# EAGLE schematic Pure Keys aec (EAGLE 8.6.0)

## Sheet 1 of 7: ATMEGA328P
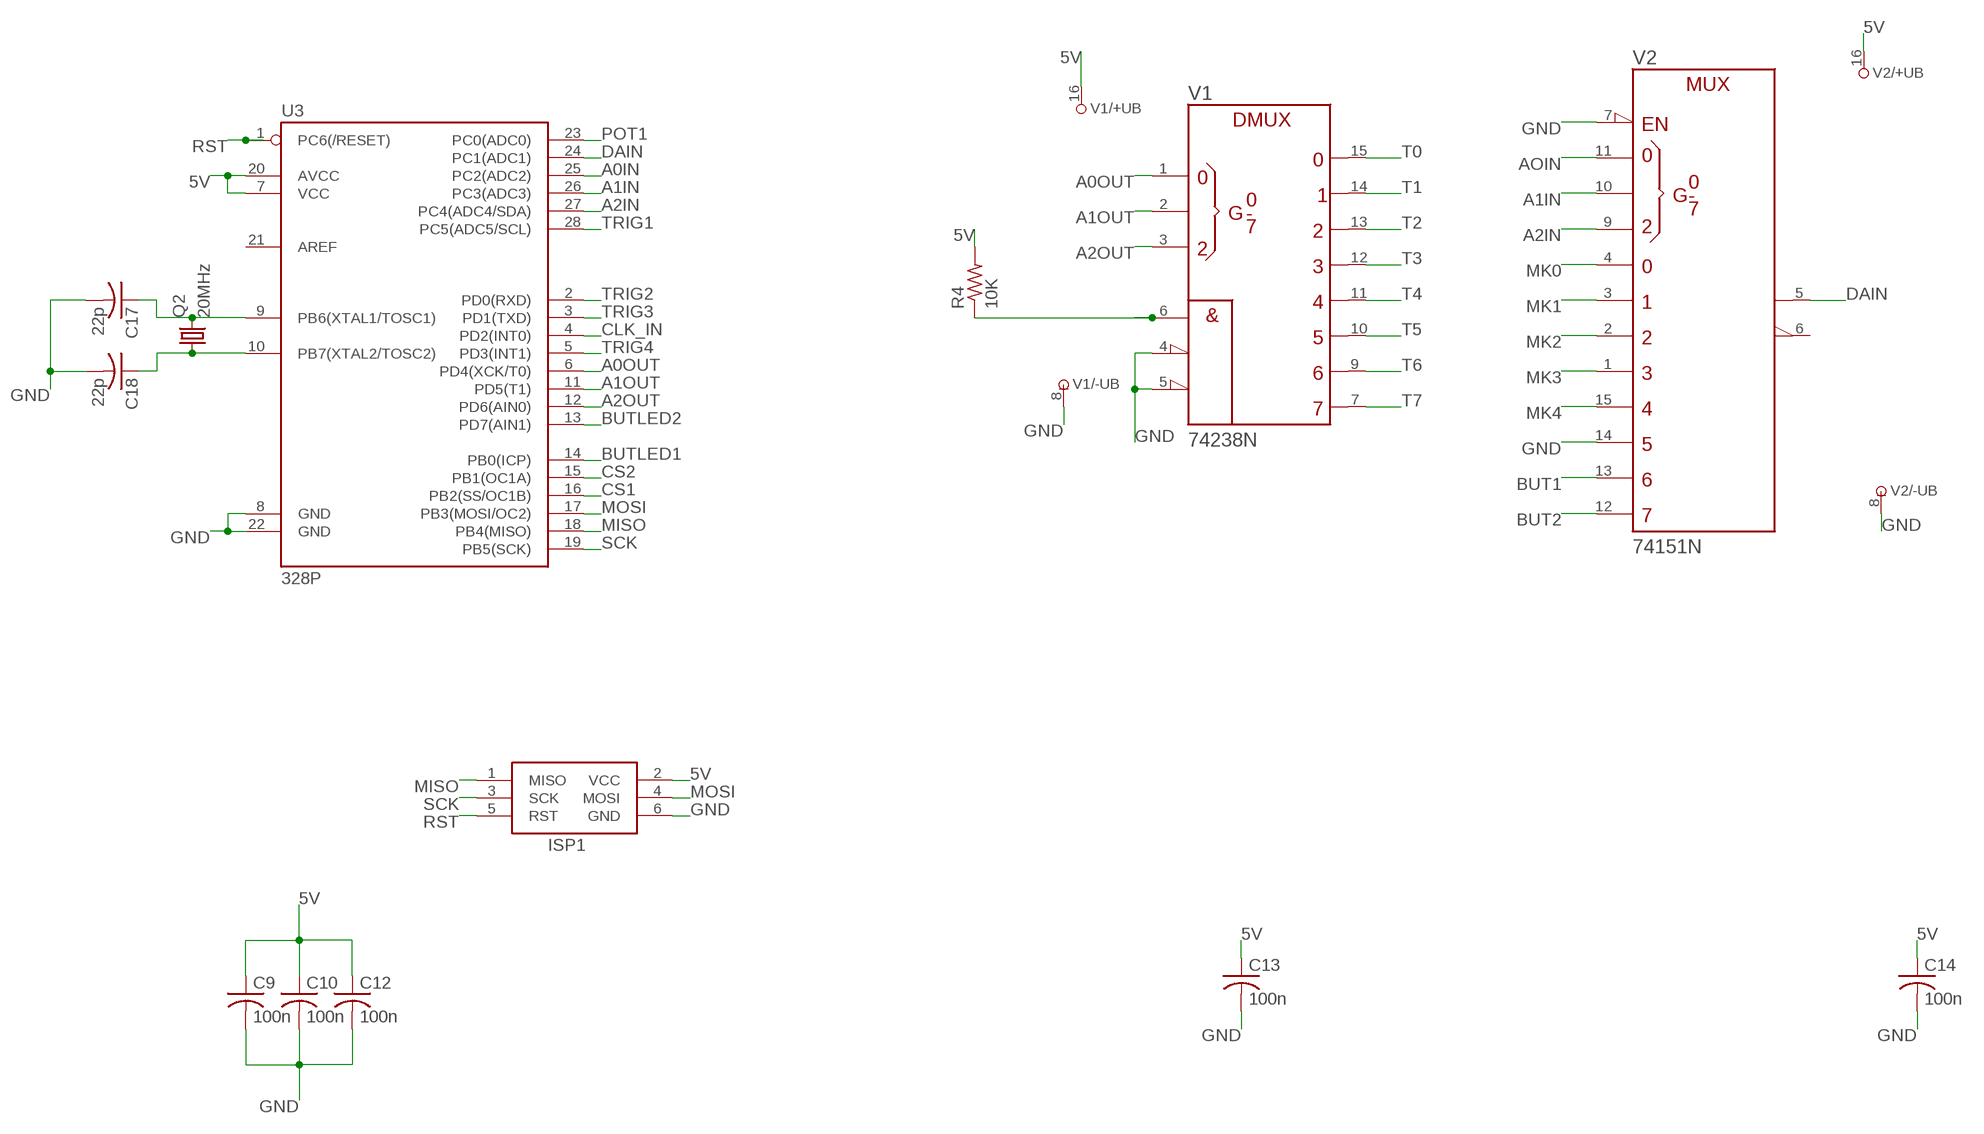
[diagram p0: schematic, sheet 1]

### Parts
C9  100n  C-USC0805K  [C0805K]
C10  100n  C-USC0805K  [C0805K]
C12  100n  C-USC0805K  [C0805K]
C13  100n  C-USC0805K  [C0805K]
C14  100n  C-USC0805K  [C0805K]
C17  22p  C-USC0805K  [C0805K]
C18  22p  C-USC0805K  [C0805K]
ISP1  AVRISP-6  [AVRISP]
Q2  20MHz  CRYSTALHC49UP  [HC49UP]
R4  10K  R-US_R0805  [R0805]
U3  328P  ATMEGA328P_PDIP  [DIP28]
V1  74238N  [DIL16]
V2  74151N  [DIL16]

### Nets
5V: C9.1 C10.1 C12.1 C13.1 C14.1 ISP1.2(VCC) R4.2 U3.7(VCC) U3.20(AVCC) V1.16(+UB) V2.16(+UB) ; also sheet 2,4,5,6,7
A0IN: U3.25(PC2(ADC2))
A0OUT: U3.6(PD4(XCK/T0)) V1.1(A)
A1IN: U3.26(PC3(ADC3)) V2.10(B)
A1OUT: U3.11(PD5(T1)) V1.2(B)
A2IN: U3.27(PC4(ADC4/SDA)) V2.9(C)
A2OUT: U3.12(PD6(AIN0)) V1.3(C)
AOIN: V2.11(A)
BUT1: V2.13(D6) ; also sheet 6
BUT2: V2.12(D7) ; also sheet 6
BUTLED1: U3.14(PB0(ICP)) ; also sheet 6
BUTLED2: U3.13(PD7(AIN1)) ; also sheet 6
CLK_IN: U3.4(PD2(INT0)) ; also sheet 7
CS1: U3.16(PB2(SS/OC1B)) ; also sheet 5
CS2: U3.15(PB1(OC1A)) ; also sheet 5
DAIN: U3.24(PC1(ADC1)) V2.5(Y)
ENOUT: R4.1 V1.6(G1)
GND: C9.2 C10.2 C12.2 C13.2 C14.2 C17.2 C18.2 ISP1.6(GND) U3.8(GND) U3.22(GND) V1.4(!G2A) V1.5(!G2B) V1.8(-UB) V2.7(!G) V2.8(-UB) V2.14(D5) ; also sheet 2,3,4,5,6,7
MISO: ISP1.1(MISO) U3.18(PB4(MISO))
MK0: V2.4(D0) ; also sheet 3
MK1: V2.3(D1) ; also sheet 3
MK2: V2.2(D2) ; also sheet 3
MK3: V2.1(D3) ; also sheet 3
MK4: V2.15(D4) ; also sheet 3
MOSI: ISP1.4(MOSI) U3.17(PB3(MOSI/OC2)) ; also sheet 5
N$10: C17.1 Q2.2 U3.9(PB6(XTAL1/TOSC1))
N$11: C18.1 Q2.1 U3.10(PB7(XTAL2/TOSC2))
POT1: U3.23(PC0(ADC0)) ; also sheet 6
RST: ISP1.5(RST) U3.1(PC6(/RESET))
SCK: ISP1.3(SCK) U3.19(PB5(SCK)) ; also sheet 5
T0: V1.15(Y0) ; also sheet 3
T1: V1.14(Y1) ; also sheet 3
T2: V1.13(Y2) ; also sheet 3
T3: V1.12(Y3) ; also sheet 3
T4: V1.11(Y4) ; also sheet 3
T5: V1.10(Y5) ; also sheet 3
T6: V1.9(Y6) ; also sheet 3
T7: V1.7(Y7) ; also sheet 3
TRIG1: U3.28(PC5(ADC5/SCL)) ; also sheet 4
TRIG2: U3.2(PD0(RXD)) ; also sheet 4
TRIG3: U3.3(PD1(TXD)) ; also sheet 4
TRIG4: U3.5(PD3(INT1)) ; also sheet 4
Unconnected: U3.21(AREF) V2.6(W)

## Sheet 2 of 7: Power
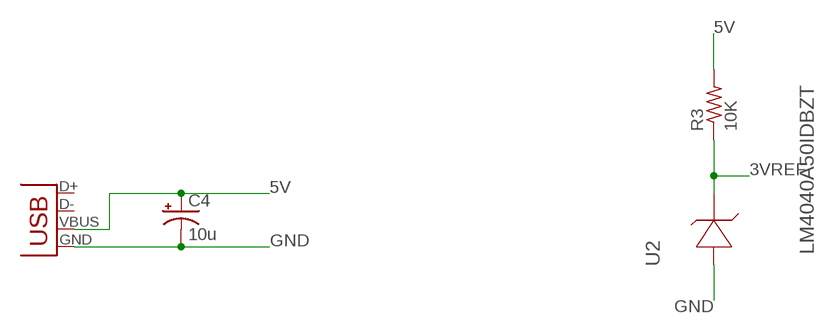
[diagram p1: schematic, sheet 2]

### Parts
C4  10u  CPOL-US153CLV-0505  [153CLV-0505]
JP2  USB-B  USBPTH  [USB-B-PTH]
R3  10K  R-US_R0805  [R0805]
U2  LM4040A50IDBZT  [SOT95P237X112-3N]

### Nets
3VREF: R3.1 U2.1(CATHODE) ; also sheet 5
5V: C4.+ JP2.VBUS R3.2 ; also sheet 1,4,5,6,7
GND: C4.- JP2.GND U2.2(ANODE) ; also sheet 1,3,4,5,6,7
Unconnected: JP2.D+ JP2.D- U2.3(NC)

## Sheet 3 of 7: Keyboard Connector
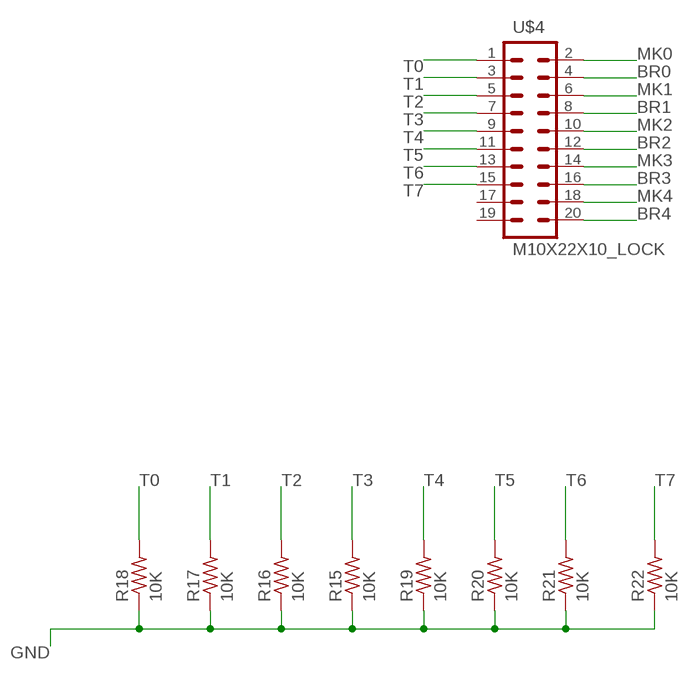
[diagram p2: schematic, sheet 3]

### Parts
R15  10K  R-US_R0805  [R0805]
R16  10K  R-US_R0805  [R0805]
R17  10K  R-US_R0805  [R0805]
R18  10K  R-US_R0805  [R0805]
R19  10K  R-US_R0805  [R0805]
R20  10K  R-US_R0805  [R0805]
R21  10K  R-US_R0805  [R0805]
R22  10K  R-US_R0805  [R0805]
U$4  M10X22X10_LOCK  [2X10_LOCK]

### Nets
BR0: U$4.4
BR1: U$4.8
BR2: U$4.12
BR3: U$4.16
BR4: U$4.20
GND: R15.1 R16.1 R17.1 R18.1 R19.1 R20.1 R21.1 R22.1 ; also sheet 1,2,4,5,6,7
MK0: U$4.2 ; also sheet 1
MK1: U$4.6 ; also sheet 1
MK2: U$4.10 ; also sheet 1
MK3: U$4.14 ; also sheet 1
MK4: U$4.18 ; also sheet 1
T0: R18.2 U$4.1 ; also sheet 1
T1: R17.2 U$4.3 ; also sheet 1
T2: R16.2 U$4.5 ; also sheet 1
T3: R15.2 U$4.7 ; also sheet 1
T4: R19.2 U$4.9 ; also sheet 1
T5: R20.2 U$4.11 ; also sheet 1
T6: R21.2 U$4.13 ; also sheet 1
T7: R22.2 U$4.15 ; also sheet 1
Unconnected: U$4.17 U$4.19

## Sheet 4 of 7: Triggers
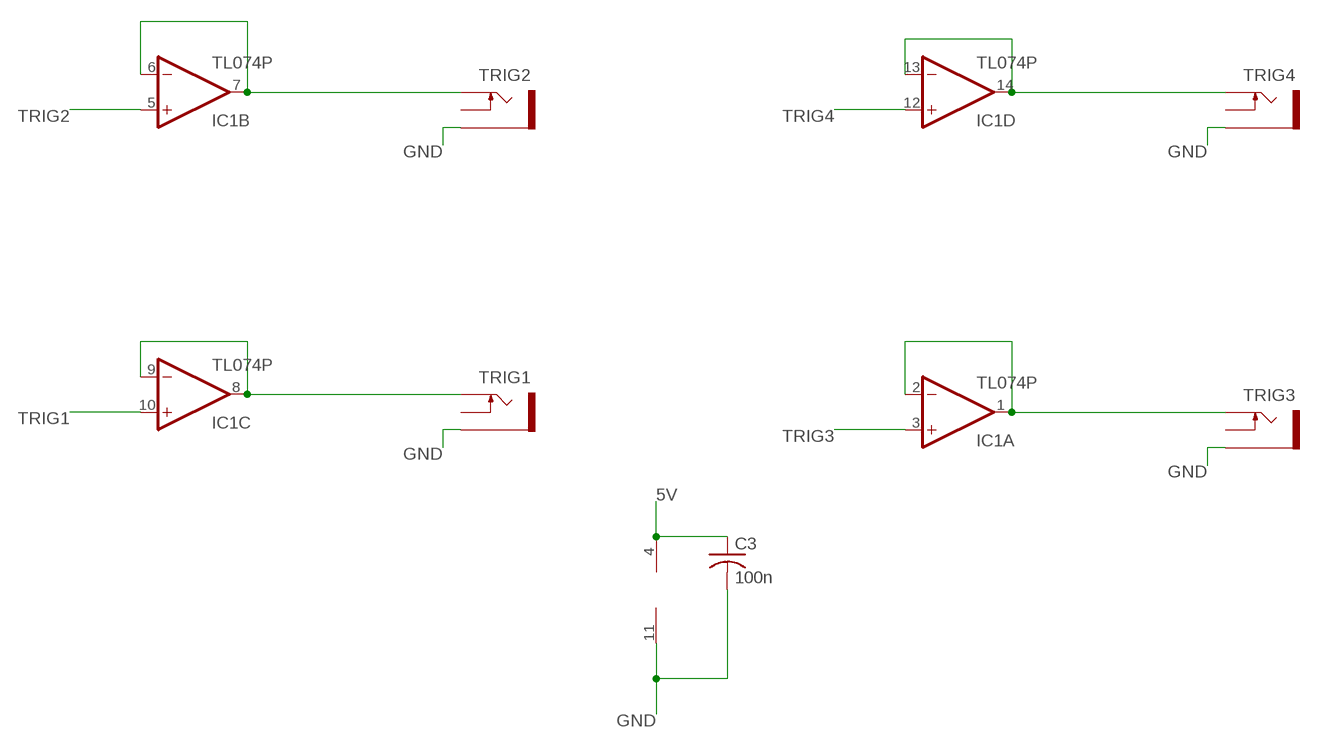
[diagram p3: schematic, sheet 4]

### Parts
C3  100n  C-USC0805K  [C0805K]
IC1  TL074P  [DIL14]
TRIG1  PJ302M  [PJ302M]
TRIG2  PJ302M  [PJ302M]
TRIG3  PJ302M  [PJ302M]
TRIG4  PJ302M  [PJ302M]

### Nets
5V: C3.1 IC1.4(P:V+) ; also sheet 1,2,5,6,7
GND: C3.2 IC1.11(P:V-) TRIG1.GND(SLEEVE) TRIG2.GND(SLEEVE) TRIG3.GND(SLEEVE) TRIG4.GND(SLEEVE) ; also sheet 1,2,3,5,6,7
N$3: IC1.6(B:-IN) IC1.7(B:OUT) TRIG2.TIP
N$4: IC1.8(C:OUT) IC1.9(C:-IN) TRIG1.TIP
N$5: IC1.13(D:-IN) IC1.14(D:OUT) TRIG4.TIP
N$6: IC1.1(A:OUT) IC1.2(A:-IN) TRIG3.TIP
TRIG1: IC1.10(C:+IN) ; also sheet 1
TRIG2: IC1.5(B:+IN) ; also sheet 1
TRIG3: IC1.3(A:+IN) ; also sheet 1
TRIG4: IC1.12(D:+IN) ; also sheet 1
Unconnected: TRIG1.SW(SWITCH) TRIG2.SW(SWITCH) TRIG3.SW(SWITCH) TRIG4.SW(SWITCH)

## Sheet 5 of 7: CV Out
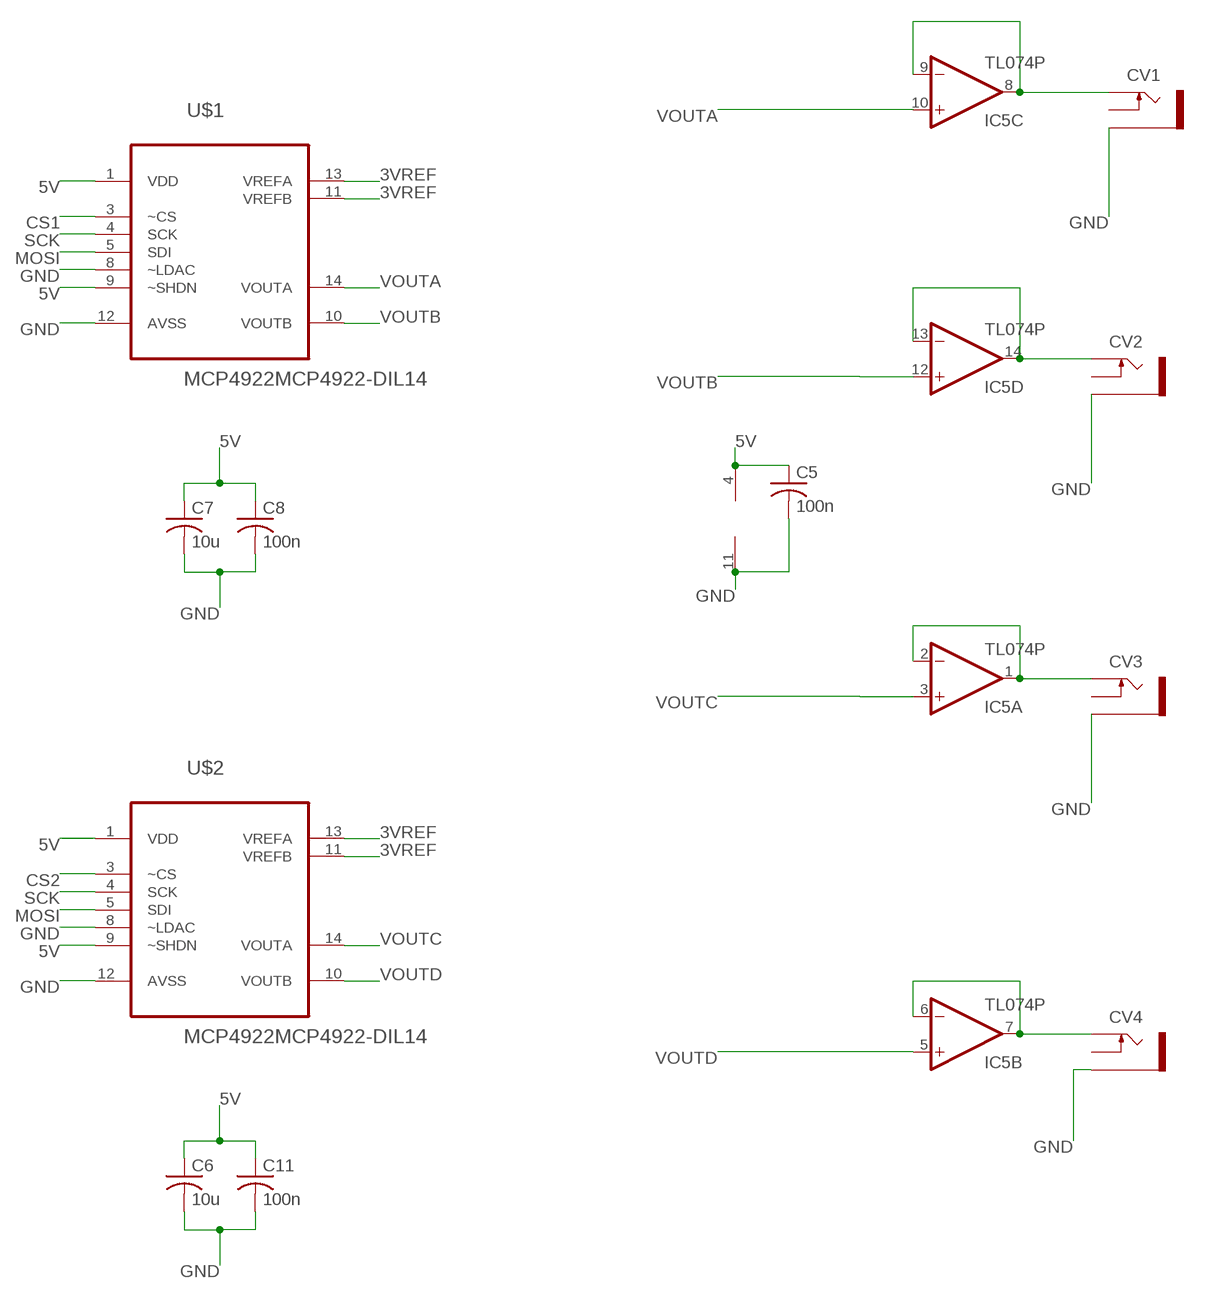
[diagram p4: schematic, sheet 5]

### Parts
C5  100n  C-USC0805K  [C0805K]
C6  10u  C-USC0805K  [C0805K]
C7  10u  C-USC0805K  [C0805K]
C8  100n  C-USC0805K  [C0805K]
C11  100n  C-USC0805K  [C0805K]
CV1  PJ302M  [PJ302M]
CV2  PJ302M  [PJ302M]
CV3  PJ302M  [PJ302M]
CV4  PJ302M  [PJ302M]
IC5  TL074P  [DIL14]
U$1  MCP4922MCP4922-DIL14  [DIL14]
U$2  MCP4922MCP4922-DIL14  [DIL14]

### Nets
3VREF: U$1.11(VREFB) U$1.13(VREFA) U$2.11(VREFB) U$2.13(VREFA) ; also sheet 2
5V: C5.1 C6.1 C7.1 C8.1 C11.1 IC5.4(P:V+) U$1.1(VDD) U$1.9(~SHDN) U$2.1(VDD) U$2.9(~SHDN) ; also sheet 1,2,4,6,7
CS1: U$1.3(~CS) ; also sheet 1
CS2: U$2.3(~CS) ; also sheet 1
GND: C5.2 C6.2 C7.2 C8.2 C11.2 CV1.GND(SLEEVE) CV2.GND(SLEEVE) CV3.GND(SLEEVE) CV4.GND(SLEEVE) IC5.11(P:V-) U$1.8(~LDAC) U$1.12(AVSS) U$2.8(~LDAC) U$2.12(AVSS) ; also sheet 1,2,3,4,6,7
MOSI: U$1.5(SDI) U$2.5(SDI) ; also sheet 1
N$7: CV1.TIP IC5.8(C:OUT) IC5.9(C:-IN)
N$25: CV4.TIP IC5.6(B:-IN) IC5.7(B:OUT)
N$31: CV3.TIP IC5.1(A:OUT) IC5.2(A:-IN)
N$36: CV2.TIP IC5.13(D:-IN) IC5.14(D:OUT)
SCK: U$1.4(SCK) U$2.4(SCK) ; also sheet 1
VOUTA: IC5.10(C:+IN) U$1.14(VOUTA)
VOUTB: IC5.12(D:+IN) U$1.10(VOUTB)
VOUTC: IC5.3(A:+IN) U$2.14(VOUTA)
VOUTD: IC5.5(B:+IN) U$2.10(VOUTB)
Unconnected: CV1.SW(SWITCH) CV2.SW(SWITCH) CV3.SW(SWITCH) CV4.SW(SWITCH)

## Sheet 6 of 7: Pots and Buttons
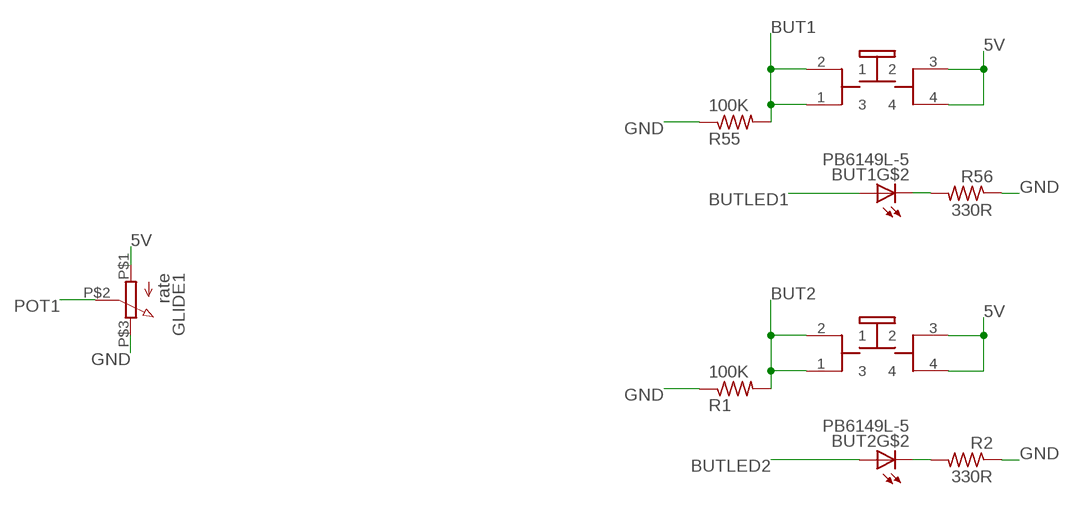
[diagram p5: schematic, sheet 6]

### Parts
BUT1  PB6149L-5  [PB6149L]
BUT2  PB6149L-5  [PB6149L]
GLIDE1  rate  9MMPOT  [POT]
R1  100K  R-US_R0805  [R0805]
R2  330R  R-US_R0805  [R0805]
R55  100K  R-US_R0805  [R0805]
R56  330R  R-US_R0805  [R0805]

### Nets
5V: BUT1.3 BUT1.4 BUT2.3 BUT2.4 GLIDE1.P$1 ; also sheet 1,2,4,5,7
BUT1: BUT1.1 BUT1.2 R55.2 ; also sheet 1
BUT2: BUT2.1 BUT2.2 R1.2 ; also sheet 1
BUTLED1: BUT1.A ; also sheet 1
BUTLED2: BUT2.A ; also sheet 1
GND: GLIDE1.P$3 R1.1 R2.1 R55.1 R56.1 ; also sheet 1,2,3,4,5,7
N$8: BUT2.K(C) R2.2
N$65: BUT1.K(C) R56.2
POT1: GLIDE1.P$2 ; also sheet 1

## Sheet 7 of 7: Clock
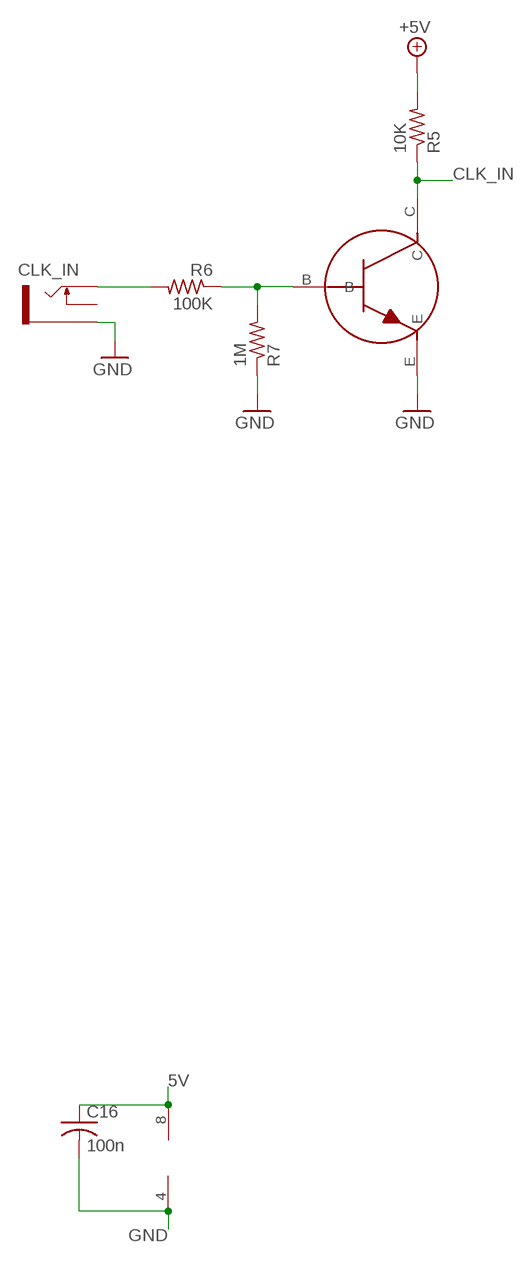
[diagram p6: schematic, sheet 7]

### Parts
C16  100n  C-USC0805K  [C0805K]
CLK_IN  PJ302M  [PJ302M]
IC2  TL072P  [DIL08]
R5  10K  R-US_R0805  [R0805]
R6  100K  R-US_R0805  [R0805]
R7  1M  R-US_R0805  [R0805]
T1  2N3904  TRANSISTOR_MMBT3904  [TRANSISTOR_SINGLE_N-TYPE]

### Nets
5V: C16.1 IC2.8(P:V+) R5.2 ; supply symbol labelled +5V ; also sheet 1,2,4,5,6
CLK_IN: R5.1 T1.C ; also sheet 1
GND: C16.2 CLK_IN.GND(SLEEVE) IC2.4(P:V-) R7.1 T1.E ; also sheet 1,2,3,4,5,6
N$17: R6.1 R7.2 T1.B
N$26: CLK_IN.TIP R6.2
Unconnected: CLK_IN.SW(SWITCH) IC2.1(A:OUT) IC2.2(A:-IN) IC2.3(A:+IN) IC2.5(B:+IN) IC2.6(B:-IN) IC2.7(B:OUT)

## Library data of the parts
BUT1 BUT2 = INSTRUO:PB6149L-5
C3 C5-C14 C16-C18 = rcl:C-US: CAPACITOR, American symbol
C4 = rcl:CPOL-US: POLARIZED CAPACITOR, American symbol
CLK_IN CV1-CV4 TRIG1-TRIG4 = GMSN:PJ302M: PJ302M horizontal / right angled mount 3.5 mm jack socket
GLIDE1 = GMSN:9MMPOT
IC1 IC5 = GMSN:TL074: OP AMP
IC2 = GMSN:TL072: OP AMP
ISP1 = adafruit:AVRISP: AVR ISP HEADER Standard 6 pin header for AVR programming
JP2 = SparkFun-Connectors:USB: USB Connectors USB-B-PTH is fully proven SKU : PRT-00139/CONN-08278 USB-miniB is fully proven SKU : PRT-00587 USB-A-PCB is untested. USB-A-H is throughly reviewed, but untested. Spark Fun Electronics SKU : PRT-00437 USB-B-SMT is throughly reviewed, but untested. Needs silkscreen touching up. USB-A-S has not been used/tested USB-MB-H has not been used/tested USB-MICROB has been used. CONN-09505; PROD_ID: CONN-08278
Q2 = adafruit:CRYSTAL: CRYSTAL; OC_FARNELL: unknown; OC_NEWARK: unknown
R1-R7 R15-R22 R55 R56 = rcl:R-US_: RESISTOR, American symbol
T1 = INSTRUO:TRANSISTOR_MMBT3904
U2 = GMSN:LM4040A50IDBZT: PRECISION MICROPOWER SHUNT VOLTAGE REFERENCE; MPN: LM4040A50IDBZT; OC_FARNELL: 1755108; OC_NEWARK: 58K5870; PACKAGE: 3-SOT-23; SUPPLIER: TEXAS INSTRUMENTS
U3 = SparkFun-IC-Microcontroller:ATMEGA328P_PDIP: Atmel 328P Through hole ATMEGA328P uC used in the Arduino 32kb flash, 1k EEPROM, 2k SRAM Datasheet <http://www.sparkfun.com/datasheets/Components/SMD/ATMega328.pdf> SparkFun Products Storefront component: AVR 28 Pin 20MHz 32K 6A/D - ATMega328P <https://www.sparkfun.com/products/9061> (COM-09061) SparkFun Simon Says - Through-Hole Soldering Kit <https://www.sparkfun.com/products/10547> (KIT-10547) SparkFun Learn to Solder - Simon Says <https://www.sparkfun.com/products/13708> (KIT-13708) SparkFun BigTime Watch Kit <https://www.sparkfun.com/products/11734> (KIT-11734) SparkFun ClockIt <https://www.sparkfun.com/products/10930> (KIT-10930) SparkFun Serial Enabled LCD Kit <https://www.sparkfun.com/products/10097> (LCD-10097) SparkFun Simon Tilts - Through Hole Soldering Kit <https://www.sparkfun.com/products/12634> (KIT-12634) SparkFun Frequency Counter Kit <https://www.sparkfun.com/products/10140> (KIT-10140) FabFM Radio Kit <https://www.sparkfun.com/products/11043> (KIT-11043) SparkFun Binary Blaster Kit <https://www.sparkfun.com/products/12037> (KIT-12037) SparkFun Metro-Gnome <https://www.sparkfun.com/products/9236> (KIT-09236) ATmega328 with Arduino Optiboot (Uno) <https://www.sparkfun.com/products/10524> (DEV-10524); PROD_ID: IC-09136
U$1 U$2 = GMSN-R2Project:MCP4922
U$4 = SparkFun-Connectors:M10X2: This was SPECIALLY designed to be used with our Graphic LCD Backpack. Be sure you want to use this! It is not only staggered on each line of header holes, but IT IS ALSO offset of the center point of the top and bottom lines by 5 mil. This causes the headers to lock into place on the "standard" footprint on the LCD screen. The extra squares on the tdocu layer are there simply to reference other pins (if you were to actually populate a longer header than ten long - this is what we do with the backpacks).
V1 = 74ttl-din:74*238: 1 of 8 noninverting DECODER/DEMULTIPLEXER
V2 = 74ttl-din:74*151: Data SELECTOR/MULTIPLEXER